# Altium project XC7K325T_POWER.PrjPcb
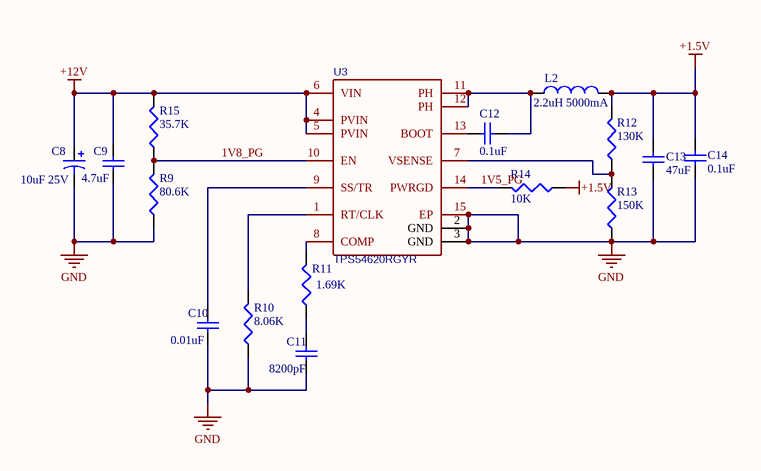
[diagram p0: POWER_1.5V_6A.SchDoc]
13 sheets, 95 parts. Net scope: global (net labels, ports and power ports of the same name join across sheets).
Board file: FPGA_POWER.PcbDoc
Sheets:
  POWER_1.5V_6A.SchDoc
  POWER_1.8V_3A.SchDoc
  POWER_2.5V_3A.SchDoc
  POWER_3.3V_6A.SchDoc
  POWER_5.0V_6A.SchDoc
  MGTAVCC.SchDoc
  MGTAVTT.SchDoc
  MGT_1.8V.SchDoc
  DDR_VREF.SchDoc
  POWER_IN.SchDoc
  POWER_OUT.SchDoc
  5V_DIMM_VCCO.SchDoc
  POWER_CORE.SchDoc

## Sheet POWER_1.5V_6A.SchDoc
size A4

### Parts
C8  value 10uF 25V  [47UF_16V]  (hidden comment: Cap Pol1)
C9  value 4.7uF  [C1210]  (hidden comment: Cap Semi)
C10  value 0.01uF  [C1210]  (hidden comment: Cap Semi)
C11  value 8200pF  [C1210]  (hidden comment: Cap Semi)
C12  value 0.1uF  [C1210]  (hidden comment: Cap Semi)
C13  value 47uF  [C1210]  (hidden comment: Cap Semi)
C14  value 0.1uF  [C1210]  (hidden comment: Cap Semi)
L2  value 2.2uH 5000mA  [IND-SMD_L5.5-W5.2]  (hidden comment: Inductor)
R9  value 80.6K  [J1-0603]  (hidden comment: Res3)
R10  value 8.06K  [J1-0603]  (hidden comment: Res3)
R11  value 1.69K  [J1-0603]  (hidden comment: Res3)
R12  value 130K  [J1-0603]  (hidden comment: Res3)
R13  value 150K  [J1-0603]  (hidden comment: Res3)
R14  value 10K  [J1-0603]  (hidden comment: Res3)
R15  value 35.7K  [J1-0603]  (hidden comment: Res3)
U3  TPS54620RGYR  [VQFN-14_L3.5-W3.5-P0.50-TL-EP_TPS54622RHLT]

### Nets
+1.5V: C13.1 C14.1 L2.2 R12.2 R14.1
+12V: C8.1 C9.2 R15.2 U3.4(PVIN) U3.5(PVIN) U3.6(VIN)
GND: C8.2 C9.1 C10.1 C11.1 C13.2 C14.2 R9.1 R10.1 R13.1 U3.2(GND) U3.3(GND) U3.15(EP)
1V5_PG: R14.2 U3.14(PWRGD)
1V8_PG: R9.2 R15.1 U3.10(EN)
NetC10_2: C10.2 U3.9(SS/TR)
NetC11_2: C11.2 R11.1
NetC12_1: C12.1 L2.1 U3.11(PH) U3.12(PH)
NetC12_2: C12.2 U3.13(BOOT)
NetR10_2: R10.2 U3.1(RT/CLK)
NetR11_2: R11.2 U3.8(COMP)
NetR12_1: R12.1 R13.2 U3.7(VSENSE)

### Library data of the parts
C8 = Cap Pol1: Polarized Capacitor (Radial); Published: 8-Jun-2000; LatestRevisionDate: 17-Jul-2002; LatestRevisionNote: Re-released for DXP Platform.; PackageReference: RB7.6-15; Publisher: Altium Limited; PackageDescription: Polarized Capacitor (Radial); 2 Leads
C9-C14 = Cap Semi: Capacitor (Semiconductor SIM Model); Published: 8-Jun-2000; LatestRevisionDate: 29-May-2009; LatestRevisionNote: IPC-7351 Footprint Added.; PackageReference: C1206; Publisher: Altium Limited; PackageDescription: Chip Capacitor
L2 = Inductor: Code_IEC: 1005; Published: 8-Jun-2000; LatestRevisionDate: 29-May-2009; LatestRevisionNote: IPC-7351 Footprint Added.; PackageReference: 0402-A; Publisher: Altium Limited; PackageDescription: Chip Inductor; Code_JEITA: 0402
R9-R15 = Res3: Resistor; Published: 8-Jun-2000; LatestRevisionDate: 29-May-2009; LatestRevisionNote: IPC-7351 Footprint Added.; PackageReference: J1-0603; Publisher: Altium Limited; PackageDescription: Chip Resistor
U3 = TPS54620RGYR: BOM_Manufacturer: TI; BOM_Supplier: LCSC; BOM_Manufacturer Part: TPS54620RGYR; image: //image.lceda.cn/szlcsc/C29438.jpg; BOM_Supplier Part: C29438; spicePre: U; spiceSymbolName: TPS54620RGYR

## Sheet POWER_1.8V_3A.SchDoc
size A4
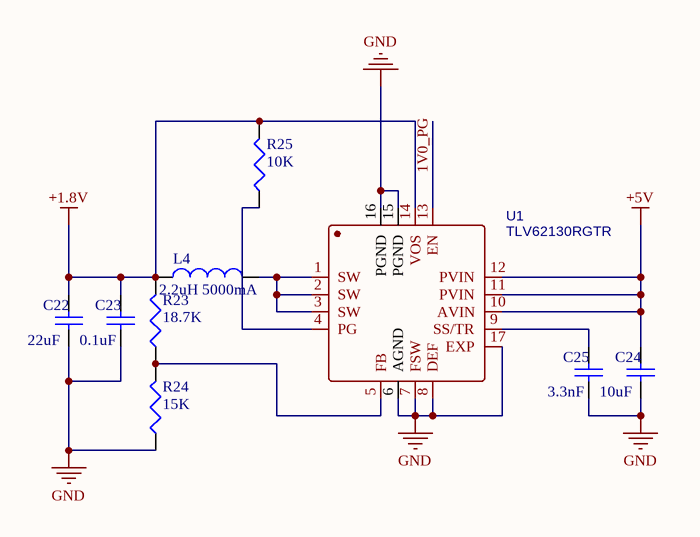
[diagram p1: POWER_1.8V_3A.SchDoc]

### Parts
C22  value 22uF  [C1210]  (hidden comment: Cap Semi)
C23  value 0.1uF  [C1210]  (hidden comment: Cap Semi)
C24  value 10uF  [C1210]  (hidden comment: Cap Semi)
C25  value 3.3nF  [C1210]  (hidden comment: Cap Semi)
L4  value 2.2uH 5000mA  [IND-SMD_L5.5-W5.2]  (hidden comment: Inductor)
R23  value 18.7K  [J1-0603]  (hidden comment: Res3)
R24  value 15K  [J1-0603]  (hidden comment: Res3)
R25  value 10K  [J1-0603]  (hidden comment: Res3)
U1  TLV62130RGTR  [QFN-16]

### Nets
+1.8V: C22.2 C23.2 L4.1 R23.2 R25.2 U1.14(VOS)
+5V: C24.2 U1.10(AVIN) U1.11(PVIN) U1.12(PVIN)
GND: C22.1 C23.1 C24.1 C25.1 R24.1 U1.6(AGND) U1.7(FSW) U1.8(DEF) U1.15(PGND) U1.16(PGND) U1.17(EXP)
1V0_PG: U1.13(EN)
NetC25_2: C25.2 U1.9(SS/TR)
NetL4_2: L4.2 U1.1(SW) U1.2(SW) U1.3(SW)
NetR23_1: R23.1 R24.2 U1.5(FB)
NetR25_1: R25.1 U1.4(PG)

### Library data of the parts
C22-C25 = Cap Semi: Capacitor (Semiconductor SIM Model); Published: 8-Jun-2000; LatestRevisionDate: 29-May-2009; LatestRevisionNote: IPC-7351 Footprint Added.; PackageReference: C1206; Publisher: Altium Limited; PackageDescription: Chip Capacitor
L4 = Inductor: Code_IEC: 1005; Published: 8-Jun-2000; LatestRevisionDate: 29-May-2009; LatestRevisionNote: IPC-7351 Footprint Added.; PackageReference: 0402-A; Publisher: Altium Limited; PackageDescription: Chip Inductor; Code_JEITA: 0402
R23-R25 = Res3: Resistor; Published: 8-Jun-2000; LatestRevisionDate: 29-May-2009; LatestRevisionNote: IPC-7351 Footprint Added.; PackageReference: J1-0603; Publisher: Altium Limited; PackageDescription: Chip Resistor
U1 = TLV62130RGTR: BOM_Manufacturer: TI; Contributor: LCSC; SMT Type: Extend; BOM_Supplier: LCSC; BOM_Manufacturer Part: TLV62130RGTR; BOM_Supplier Part: C122479; BOM_LCSC Assembly: Yes; spicePre: U; spiceSymbolName: TLV62130RGTR

## Sheet POWER_2.5V_3A.SchDoc
size A4
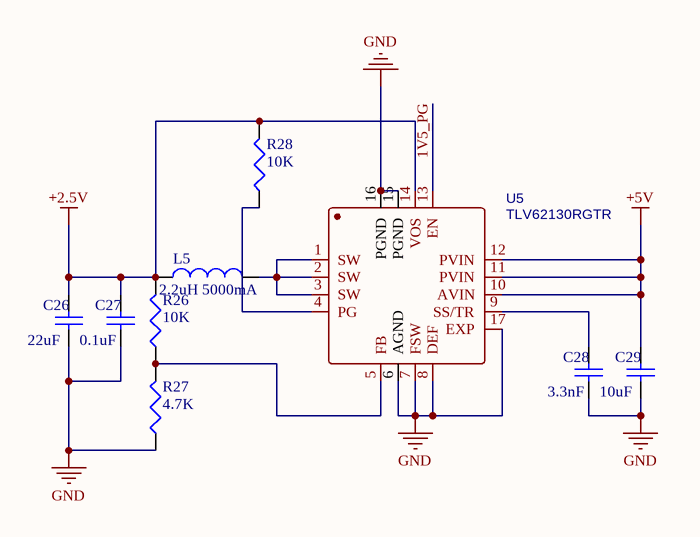
[diagram p2: POWER_2.5V_3A.SchDoc]

### Parts
C26  value 22uF  [C1210]  (hidden comment: Cap Semi)
C27  value 0.1uF  [C1210]  (hidden comment: Cap Semi)
C28  value 3.3nF  [C1210]  (hidden comment: Cap Semi)
C29  value 10uF  [C1210]  (hidden comment: Cap Semi)
L5  value 2.2uH 5000mA  [IND-SMD_L5.5-W5.2]  (hidden comment: Inductor)
R26  value 10K  [J1-0603]  (hidden comment: Res3)
R27  value 4.7K  [J1-0603]  (hidden comment: Res3)
R28  value 10K  [J1-0603]  (hidden comment: Res3)
U5  TLV62130RGTR  [QFN-16]

### Nets
+2.5V: C26.2 C27.2 L5.1 R26.2 R28.2 U5.14(VOS)
+5V: C29.2 U5.10(AVIN) U5.11(PVIN) U5.12(PVIN)
GND: C26.1 C27.1 C28.1 C29.1 R27.1 U5.6(AGND) U5.7(FSW) U5.8(DEF) U5.15(PGND) U5.16(PGND) U5.17(EXP)
1V5_PG: U5.13(EN)
NetC28_2: C28.2 U5.9(SS/TR)
NetL5_2: L5.2 U5.1(SW) U5.2(SW) U5.3(SW)
NetR26_1: R26.1 R27.2 U5.5(FB)
NetR28_1: R28.1 U5.4(PG)

### Library data of the parts
C26-C29 = Cap Semi: Capacitor (Semiconductor SIM Model); Published: 8-Jun-2000; LatestRevisionDate: 29-May-2009; LatestRevisionNote: IPC-7351 Footprint Added.; PackageReference: C1206; Publisher: Altium Limited; PackageDescription: Chip Capacitor
L5 = Inductor: Code_IEC: 1005; Published: 8-Jun-2000; LatestRevisionDate: 29-May-2009; LatestRevisionNote: IPC-7351 Footprint Added.; PackageReference: 0402-A; Publisher: Altium Limited; PackageDescription: Chip Inductor; Code_JEITA: 0402
R26-R28 = Res3: Resistor; Published: 8-Jun-2000; LatestRevisionDate: 29-May-2009; LatestRevisionNote: IPC-7351 Footprint Added.; PackageReference: J1-0603; Publisher: Altium Limited; PackageDescription: Chip Resistor
U5 = TLV62130RGTR: as U1 on sheet POWER_1.8V_3A; BOM_Supplier: LCSC; BOM_Manufacturer Part: TLV62130RGTR; BOM_Supplier Part: C122479; BOM_LCSC Assembly: Yes; spicePre: U; spiceSymbolName: TLV62130RGTR

## Sheet POWER_3.3V_6A.SchDoc
size A4
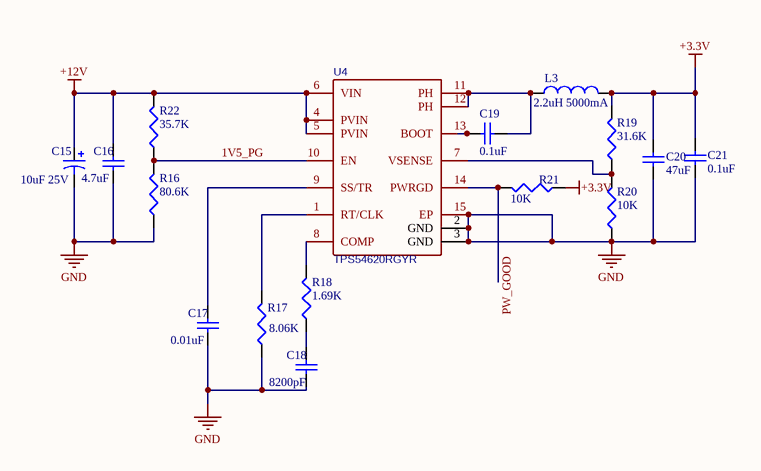
[diagram p3: POWER_3.3V_6A.SchDoc]

### Parts
C15  value 10uF 25V  [47UF_16V]  (hidden comment: Cap Pol1)
C16  value 4.7uF  [C1210]  (hidden comment: Cap Semi)
C17  value 0.01uF  [C1210]  (hidden comment: Cap Semi)
C18  value 8200pF  [C1210]  (hidden comment: Cap Semi)
C19  value 0.1uF  [C1210]  (hidden comment: Cap Semi)
C20  value 47uF  [C1210]  (hidden comment: Cap Semi)
C21  value 0.1uF  [C1210]  (hidden comment: Cap Semi)
L3  value 2.2uH 5000mA  [IND-SMD_L5.5-W5.2]  (hidden comment: Inductor)
R16  value 80.6K  [J1-0603]  (hidden comment: Res3)
R17  value 8.06K  [J1-0603]  (hidden comment: Res3)
R18  value 1.69K  [J1-0603]  (hidden comment: Res3)
R19  value 31.6K  [J1-0603]  (hidden comment: Res3)
R20  value 10K  [J1-0603]  (hidden comment: Res3)
R21  value 10K  [J1-0603]  (hidden comment: Res3)
R22  value 35.7K  [J1-0603]  (hidden comment: Res3)
U4  TPS54620RGYR  [VQFN-14_L3.5-W3.5-P0.50-TL-EP_TPS54622RHLT]

### Nets
+3.3V: C20.1 C21.1 L3.2 R19.2 R21.1
+12V: C15.1 C16.2 R22.2 U4.4(PVIN) U4.5(PVIN) U4.6(VIN)
GND: C15.2 C16.1 C17.1 C18.1 C20.2 C21.2 R16.1 R17.1 R20.1 U4.2(GND) U4.3(GND) U4.15(EP)
1V5_PG: R16.2 R22.1 U4.10(EN)
PW_GOOD: R21.2 U4.14(PWRGD)
NetC17_2: C17.2 U4.9(SS/TR)
NetC18_2: C18.2 R18.1
NetC19_1: C19.1 L3.1 U4.11(PH) U4.12(PH)
NetC19_2: C19.2 U4.13(BOOT)
NetR17_2: R17.2 U4.1(RT/CLK)
NetR18_2: R18.2 U4.8(COMP)
NetR19_1: R19.1 R20.2 U4.7(VSENSE)

### Library data of the parts
C15 = Cap Pol1: Polarized Capacitor (Radial); Published: 8-Jun-2000; LatestRevisionDate: 17-Jul-2002; LatestRevisionNote: Re-released for DXP Platform.; PackageReference: RB7.6-15; Publisher: Altium Limited; PackageDescription: Polarized Capacitor (Radial); 2 Leads
C16-C21 = Cap Semi: Capacitor (Semiconductor SIM Model); Published: 8-Jun-2000; LatestRevisionDate: 29-May-2009; LatestRevisionNote: IPC-7351 Footprint Added.; PackageReference: C1206; Publisher: Altium Limited; PackageDescription: Chip Capacitor
L3 = Inductor: Code_IEC: 1005; Published: 8-Jun-2000; LatestRevisionDate: 29-May-2009; LatestRevisionNote: IPC-7351 Footprint Added.; PackageReference: 0402-A; Publisher: Altium Limited; PackageDescription: Chip Inductor; Code_JEITA: 0402
R16-R22 = Res3: Resistor; Published: 8-Jun-2000; LatestRevisionDate: 29-May-2009; LatestRevisionNote: IPC-7351 Footprint Added.; PackageReference: J1-0603; Publisher: Altium Limited; PackageDescription: Chip Resistor
U4 = TPS54620RGYR: BOM_Manufacturer: TI; BOM_Supplier: LCSC; BOM_Manufacturer Part: TPS54620RGYR; image: //image.lceda.cn/szlcsc/C29438.jpg; BOM_Supplier Part: C29438; spicePre: U; spiceSymbolName: TPS54620RGYR

## Sheet POWER_5.0V_6A.SchDoc
size A4
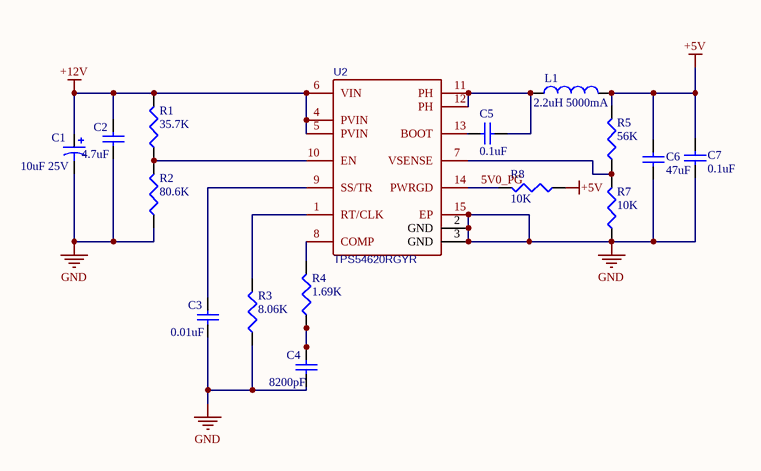
[diagram p4: POWER_5.0V_6A.SchDoc]

### Parts
C1  value 10uF 25V  [47UF_16V]  (hidden comment: Cap Pol1)
C2  value 4.7uF  [C1210]  (hidden comment: Cap Semi)
C3  value 0.01uF  [C1210]  (hidden comment: Cap Semi)
C4  value 8200pF  [C1210]  (hidden comment: Cap Semi)
C5  value 0.1uF  [C1210]  (hidden comment: Cap Semi)
C6  value 47uF  [C1210]  (hidden comment: Cap Semi)
C7  value 0.1uF  [C1210]  (hidden comment: Cap Semi)
L1  value 2.2uH 5000mA  [IND-SMD_L5.5-W5.2]  (hidden comment: Inductor)
R1  value 35.7K  [J1-0603]  (hidden comment: Res3)
R2  value 80.6K  [J1-0603]  (hidden comment: Res3)
R3  value 8.06K  [J1-0603]  (hidden comment: Res3)
R4  value 1.69K  [J1-0603]  (hidden comment: Res3)
R5  value 56K  [J1-0603]  (hidden comment: Res3)
R7  value 10K  [J1-0603]  (hidden comment: Res3)
R8  value 10K  [J1-0603]  (hidden comment: Res3)
U2  TPS54620RGYR  [VQFN-14_L3.5-W3.5-P0.50-TL-EP_TPS54622RHLT]

### Nets
+5V: C6.1 C7.1 L1.2 R5.2 R8.1
+12V: C1.1 C2.2 R1.2 U2.4(PVIN) U2.5(PVIN) U2.6(VIN)
GND: C1.2 C2.1 C3.1 C4.1 C6.2 C7.2 R2.1 R3.1 R7.1 U2.2(GND) U2.3(GND) U2.15(EP)
5V0_PG: R8.2 U2.14(PWRGD)
NetC3_2: C3.2 U2.9(SS/TR)
NetC4_2: C4.2 R4.1
NetC5_1: C5.1 L1.1 U2.11(PH) U2.12(PH)
NetC5_2: C5.2 U2.13(BOOT)
NetR1_1: R1.1 R2.2 U2.10(EN)
NetR3_2: R3.2 U2.1(RT/CLK)
NetR4_2: R4.2 U2.8(COMP)
NetR5_1: R5.1 R7.2 U2.7(VSENSE)

### Library data of the parts
C1 = Cap Pol1: Polarized Capacitor (Radial); Published: 8-Jun-2000; LatestRevisionDate: 17-Jul-2002; LatestRevisionNote: Re-released for DXP Platform.; PackageReference: RB7.6-15; Publisher: Altium Limited; PackageDescription: Polarized Capacitor (Radial); 2 Leads
C2-C7 = Cap Semi: Capacitor (Semiconductor SIM Model); Published: 8-Jun-2000; LatestRevisionDate: 29-May-2009; LatestRevisionNote: IPC-7351 Footprint Added.; PackageReference: C1206; Publisher: Altium Limited; PackageDescription: Chip Capacitor
L1 = Inductor: Code_IEC: 1005; Published: 8-Jun-2000; LatestRevisionDate: 29-May-2009; LatestRevisionNote: IPC-7351 Footprint Added.; PackageReference: 0402-A; Publisher: Altium Limited; PackageDescription: Chip Inductor; Code_JEITA: 0402
R1-R5 R7 R8 = Res3: Resistor; Published: 8-Jun-2000; LatestRevisionDate: 29-May-2009; LatestRevisionNote: IPC-7351 Footprint Added.; PackageReference: J1-0603; Publisher: Altium Limited; PackageDescription: Chip Resistor
U2 = TPS54620RGYR: BOM_Manufacturer: TI; BOM_Supplier: LCSC; BOM_Manufacturer Part: TPS54620RGYR; image: //image.lceda.cn/szlcsc/C29438.jpg; BOM_Supplier Part: C29438; spicePre: U; spiceSymbolName: TPS54620RGYR

## Sheet MGTAVCC.SchDoc
size A4
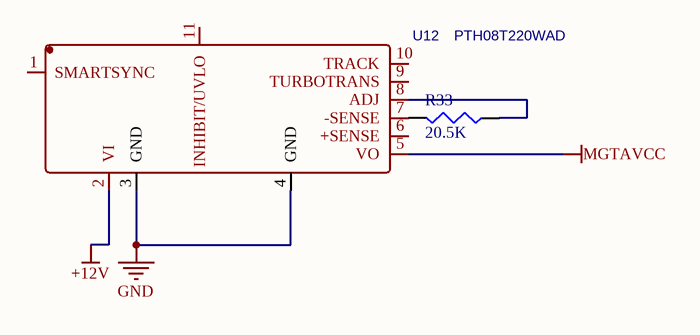
[diagram p5: MGTAVCC.SchDoc]

### Parts
R33  value 20.5K  [J1-0603]  (hidden comment: Res3)
U12  PTH08T220WAD  [PWRM-TH_11P-L23.1-W19.9-P3.17]

### Nets
+12V: U12.2(VI)
GND: U12.3(GND) U12.4(GND)
MGTAVCC: U12.5(VO)
NetR33_1: R33.1 U12.8(ADJ)
NetR33_2: R33.2 U12.7(-SENSE)

Not connected (* = marked no-connect by the designer): U12 1(SMARTSYNC) 6(+SENSE) 9(TURBOTRANS) 10(TRACK) 11(INHIBIT/UVLO)

### Library data of the parts
R33 = Res3: Resistor; Published: 8-Jun-2000; LatestRevisionDate: 29-May-2009; LatestRevisionNote: IPC-7351 Footprint Added.; PackageReference: J1-0603; Publisher: Altium Limited; PackageDescription: Chip Resistor
U12 = PTH08T220WAD: BOM_Manufacturer: Texas Instruments; Contributor: LCSC; BOM_Supplier: LCSC; BOM_Supplier Part: C79289; BOM_Manufacturer Part: PTH08T220WAD; spicePre: U; spiceSymbolName: PTH08T220WAD

## Sheet MGTAVTT.SchDoc
size A4
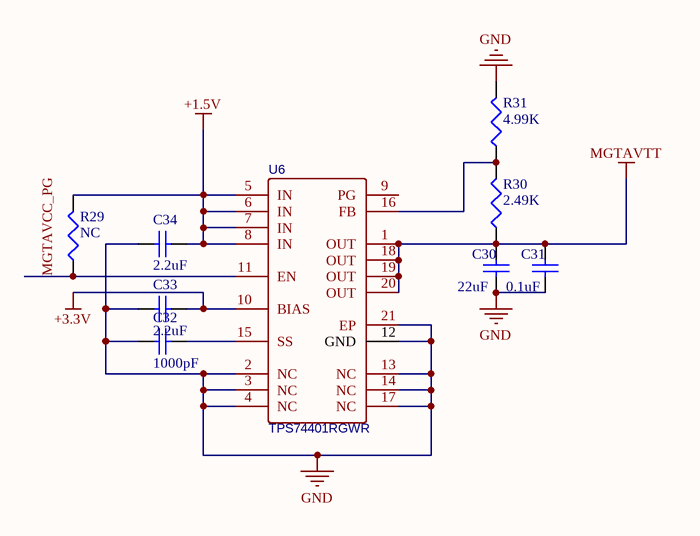
[diagram p6: MGTAVTT.SchDoc]

### Parts
C30  value 22uF  [C1210]  (hidden comment: Cap Semi)
C31  value 0.1uF  [C1210]  (hidden comment: Cap Semi)
C32  value 1000pF  [C1210]  (hidden comment: Cap Semi)
C33  value 2.2uF  [C1210]  (hidden comment: Cap Semi)
C34  value 2.2uF  [C1210]  (hidden comment: Cap Semi)
R29  value NC  [J1-0603]  (hidden comment: Res3)
R30  value 2.49K  [J1-0603]  (hidden comment: Res3)
R31  value 4.99K  [J1-0603]  (hidden comment: Res3)
U6  TPS74401RGWR  [VQFN-20_L5.0-W5.0-P0.65-TL-EP]

### Nets
+1.5V: C34.1 R29.2 U6.5(IN) U6.6(IN) U6.7(IN) U6.8(IN)
+3.3V: C33.1 U6.10(BIAS)
GND: C30.1 C31.1 C32.2 C33.2 C34.2 R31.2 U6.2(NC) U6.3(NC) U6.4(NC) U6.12(GND) U6.13(NC) U6.14(NC) U6.17(NC) U6.21(EP)
MGTAVTT: C30.2 C31.2 R30.1 U6.1(OUT) U6.18(OUT) U6.19(OUT) U6.20(OUT)
MGTAVCC_PG: R29.1 U6.11(EN)
NetC32_1: C32.1 U6.15(SS)
NetR30_2: R30.2 R31.1 U6.16(FB)

Not connected (* = marked no-connect by the designer): U6 9(PG)

### Library data of the parts
C30-C34 = Cap Semi: Capacitor (Semiconductor SIM Model); Published: 8-Jun-2000; LatestRevisionDate: 29-May-2009; LatestRevisionNote: IPC-7351 Footprint Added.; PackageReference: C1206; Publisher: Altium Limited; PackageDescription: Chip Capacitor
R29-R31 = Res3: Resistor; Published: 8-Jun-2000; LatestRevisionDate: 29-May-2009; LatestRevisionNote: IPC-7351 Footprint Added.; PackageReference: J1-0603; Publisher: Altium Limited; PackageDescription: Chip Resistor
U6 = TPS74401RGWR: BOM_Manufacturer: TI; Contributor: LCSC; BOM_Supplier: LCSC; BOM_Manufacturer Part: TPS74401RGWR; BOM_Supplier Part: C138728; spicePre: U; spiceSymbolName: TPS74401RGWR

## Sheet MGT_1.8V.SchDoc
size A4
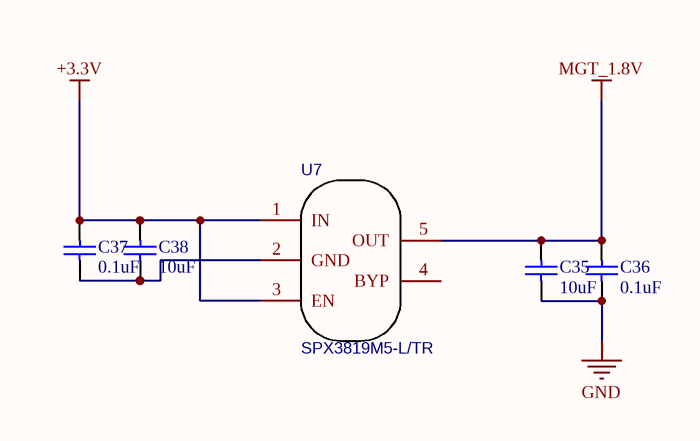
[diagram p7: MGT_1.8V.SchDoc]

### Parts
C35  value 10uF  [C1210]  (hidden comment: Cap Semi)
C36  value 0.1uF  [C1210]  (hidden comment: Cap Semi)
C37  value 0.1uF  [C1210]  (hidden comment: Cap Semi)
C38  value 10uF  [C1210]  (hidden comment: Cap Semi)
U7  SPX3819M5-L/TR  [SOT-23-5_L3.0-W1.7-P0.95-LS2.8-BL]

### Nets
+3.3V: C37.1 C38.1 U7.1(IN) U7.3(EN)
GND: C35.2 C36.2
MGT_1.8V: C35.1 C36.1 U7.5(OUT)
NetC37_2: C37.2 C38.2 U7.2(GND)

Not connected (* = marked no-connect by the designer): U7 4(BYP)

### Library data of the parts
C35-C38 = Cap Semi: Capacitor (Semiconductor SIM Model); Published: 8-Jun-2000; LatestRevisionDate: 29-May-2009; LatestRevisionNote: IPC-7351 Footprint Added.; PackageReference: C1206; Publisher: Altium Limited; PackageDescription: Chip Capacitor
U7 = SPX3819M5-L/TR: BOM_Manufacturer: EXAR; SMT Type: Extend; BOM_Supplier: LCSC; BOM_Manufacturer Part: SPX3819M5-L/TR; image: //image.lceda.cn/szlcsc/C9056.jpg; BOM_Supplier Part: C9056; BOM_LCSC Assembly: Yes; spicePre: U; spiceSymbolName: SPX3819M5-L/TR

## Sheet DDR_VREF.SchDoc
size A4
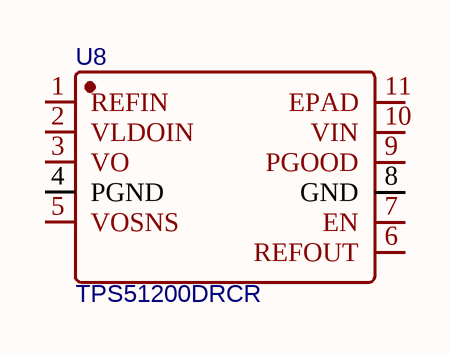
[diagram p8: DDR_VREF.SchDoc]

### Parts
U8  TPS51200DRCR  [WSON-10_L3.0-W3.0-P0.50-BL-EP]

### Nets

Not connected (* = marked no-connect by the designer): U8 1(REFIN) 2(VLDOIN) 3(VO) 4(PGND) 5(VOSNS) 6(REFOUT) 7(EN) 8(GND) 9(PGOOD) 10(VIN) 11(EPAD)

### Library data of the parts
U8 = TPS51200DRCR: BOM_Manufacturer: TI; Contributor: LCSC; BOM_Supplier: LCSC; BOM_Manufacturer Part: TPS51200DRCR; BOM_Supplier Part: C34771; spicePre: U; spiceSymbolName: TPS51200DRCR

## Sheet POWER_IN.SchDoc
size A4
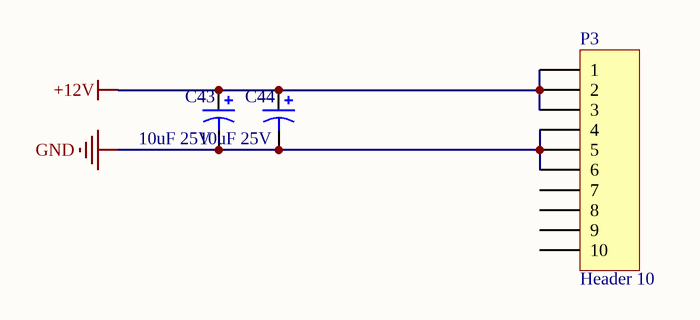
[diagram p9: POWER_IN.SchDoc]

### Parts
C43  value 10uF 25V  [470UF_16V]  (hidden comment: Cap Pol1)
C44  value 10uF 25V  [470UF_16V]  (hidden comment: Cap Pol1)
P3  Header 10  [CON_MOL_5569_6P]

### Nets
+12V: C43.1 C44.1 P3.1 P3.2 P3.3
GND: C43.2 C44.2 P3.4 P3.5 P3.6

Not connected (* = marked no-connect by the designer): P3 7 8 9 10

### Library data of the parts
C43 C44 = Cap Pol1: Polarized Capacitor (Radial); Published: 8-Jun-2000; LatestRevisionDate: 17-Jul-2002; LatestRevisionNote: Re-released for DXP Platform.; PackageReference: RB7.6-15; Publisher: Altium Limited; PackageDescription: Polarized Capacitor (Radial); 2 Leads
P3 = Header 10: Header, 10-Pin; LatestRevisionDate: 17-Jul-2002; LatestRevisionNote: Re-released for DXP Platform.; Publisher: Altium Limited

## Sheet POWER_OUT.SchDoc
size A4
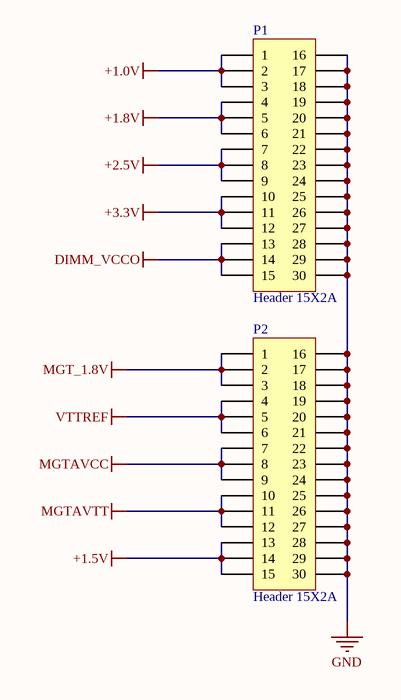
[diagram p10: POWER_OUT.SchDoc]

### Parts
P1  Header 15X2A  [HDR2X15_CEN]
P2  Header 15X2A  [HDR2X15_CEN]

### Nets
+1.0V: P1.1 P1.2 P1.3
+1.5V: P2.13 P2.14 P2.15
+1.8V: P1.4 P1.5 P1.6
+2.5V: P1.7 P1.8 P1.9
+3.3V: P1.10 P1.11 P1.12
DIMM_VCCO: P1.13 P1.14 P1.15
GND: P1.16 P1.17 P1.18 P1.19 P1.20 P1.21 P1.22 P1.23 P1.24 P1.25 P1.26 P1.27 P1.28 P1.29 P1.30 P2.16 P2.17 P2.18 P2.19 P2.20 P2.21 P2.22 P2.23 P2.24 P2.25 P2.26 P2.27 P2.28 P2.29 P2.30
MGT_1.8V: P2.1 P2.2 P2.3
MGTAVCC: P2.7 P2.8 P2.9
MGTAVTT: P2.10 P2.11 P2.12
VTTREF: P2.4 P2.5 P2.6

### Library data of the parts
P1 P2 = Header 15X2A: Header, 15-Pin, Dual row; LatestRevisionDate: 17-Jul-2002; LatestRevisionNote: Re-released for DXP Platform.; Publisher: Altium Limited

## Sheet 5V_DIMM_VCCO.SchDoc
size A4
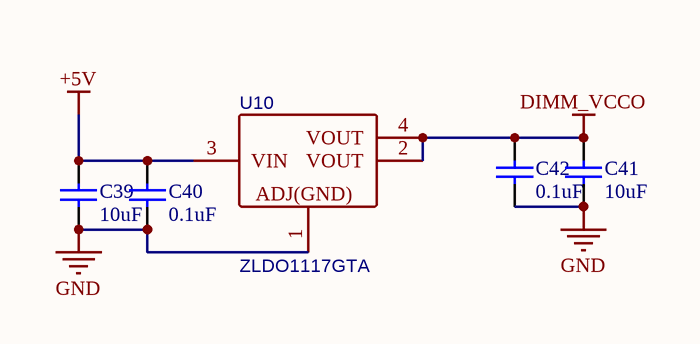
[diagram p11: 5V_DIMM_VCCO.SchDoc]

### Parts
C39  value 10uF  [C1210]  (hidden comment: Cap Semi)
C40  value 0.1uF  [C1210]  (hidden comment: Cap Semi)
C41  value 10uF  [C1210]  (hidden comment: Cap Semi)
C42  value 0.1uF  [C1210]  (hidden comment: Cap Semi)
U10  ZLDO1117GTA  [SOT-223-4_L6.5-W3.5-P2.30-LS7.0-BR]

### Nets
+5V: C39.1 C40.1 U10.3(VIN)
DIMM_VCCO: C41.1 C42.1 U10.2(VOUT) U10.4(VOUT)
GND: C39.2 C40.2 C41.2 C42.2 U10.1(ADJ(GND))

### Library data of the parts
C39-C42 = Cap Semi: Capacitor (Semiconductor SIM Model); Published: 8-Jun-2000; LatestRevisionDate: 29-May-2009; LatestRevisionNote: IPC-7351 Footprint Added.; PackageReference: C1206; Publisher: Altium Limited; PackageDescription: Chip Capacitor
U10 = ZLDO1117GTA: BOM_Manufacturer: Diodes Incorporated; Contributor: LCSC; BOM_Supplier: LCSC; BOM_Supplier Part: C443633; BOM_Manufacturer Part: ZLDO1117GTA; spicePre: U; spiceSymbolName: ZLDO1117GTA

## Sheet POWER_CORE.SchDoc
size A4
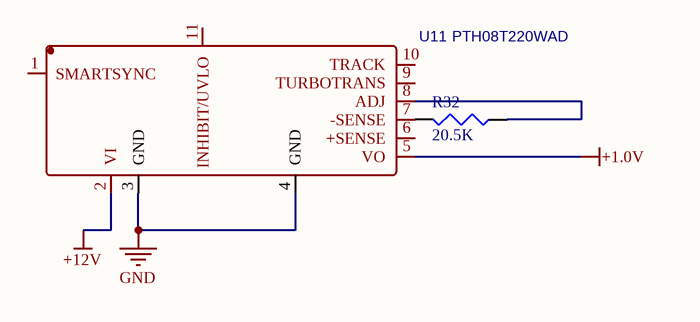
[diagram p12: POWER_CORE.SchDoc]

### Parts
R32  value 20.5K  [J1-0603]  (hidden comment: Res3)
U11  PTH08T220WAD  [PWRM-TH_11P-L23.1-W19.9-P3.17]

### Nets
+1.0V: U11.5(VO)
+12V: U11.2(VI)
GND: U11.3(GND) U11.4(GND)
NetR32_1: R32.1 U11.8(ADJ)
NetR32_2: R32.2 U11.7(-SENSE)

Not connected (* = marked no-connect by the designer): U11 1(SMARTSYNC) 6(+SENSE) 9(TURBOTRANS) 10(TRACK) 11(INHIBIT/UVLO)

### Library data of the parts
R32 = Res3: Resistor; Published: 8-Jun-2000; LatestRevisionDate: 29-May-2009; LatestRevisionNote: IPC-7351 Footprint Added.; PackageReference: J1-0603; Publisher: Altium Limited; PackageDescription: Chip Resistor
U11 = PTH08T220WAD: as U12 on sheet MGTAVCC; BOM_Supplier: LCSC; BOM_Supplier Part: C79289; BOM_Manufacturer Part: PTH08T220WAD; spicePre: U; spiceSymbolName: PTH08T220WAD

## Nets that join several sheets
+1.0V: POWER_OUT (P1.1 P1.2 P1.3), POWER_CORE (U11.5)
+1.5V: POWER_1.5V_6A (5 pins), MGTAVTT (6 pins), POWER_OUT (P2.13 P2.14 P2.15)
+1.8V: POWER_1.8V_3A (6 pins), POWER_OUT (P1.4 P1.5 P1.6)
+2.5V: POWER_2.5V_3A (6 pins), POWER_OUT (P1.7 P1.8 P1.9)
+3.3V: POWER_3.3V_6A (5 pins), MGTAVTT (C33.1 U6.10), MGT_1.8V (C37.1 C38.1 U7.1 U7.3), POWER_OUT (P1.10 P1.11 P1.12)
+5V: POWER_1.8V_3A (C24.2 U1.10 U1.11 U1.12), POWER_2.5V_3A (C29.2 U5.10 U5.11 U5.12), POWER_5.0V_6A (5 pins), 5V_DIMM_VCCO (C39.1 C40.1 U10.3)
+12V: POWER_1.5V_6A (6 pins), POWER_3.3V_6A (6 pins), POWER_5.0V_6A (6 pins), MGTAVCC (U12.2), POWER_IN (5 pins), POWER_CORE (U11.2)
DIMM_VCCO: POWER_OUT (P1.13 P1.14 P1.15), 5V_DIMM_VCCO (C41.1 C42.1 U10.2 U10.4)
GND: POWER_1.5V_6A (12 pins), POWER_1.8V_3A (11 pins), POWER_2.5V_3A (11 pins), POWER_3.3V_6A (12 pins), POWER_5.0V_6A (12 pins), MGTAVCC (U12.3 U12.4), MGTAVTT (14 pins), MGT_1.8V (C35.2 C36.2), POWER_IN (5 pins), POWER_OUT (30 pins), 5V_DIMM_VCCO (5 pins), POWER_CORE (U11.3 U11.4)
MGT_1.8V: MGT_1.8V (C35.1 C36.1 U7.5), POWER_OUT (P2.1 P2.2 P2.3)
MGTAVCC: MGTAVCC (U12.5), POWER_OUT (P2.7 P2.8 P2.9)
MGTAVTT: MGTAVTT (7 pins), POWER_OUT (P2.10 P2.11 P2.12)
1V5_PG: POWER_1.5V_6A (R14.2 U3.14), POWER_2.5V_3A (U5.13), POWER_3.3V_6A (R16.2 R22.1 U4.10)